# Altium schematic sheet 输出运算放大器（5）.SchDoc
size A4
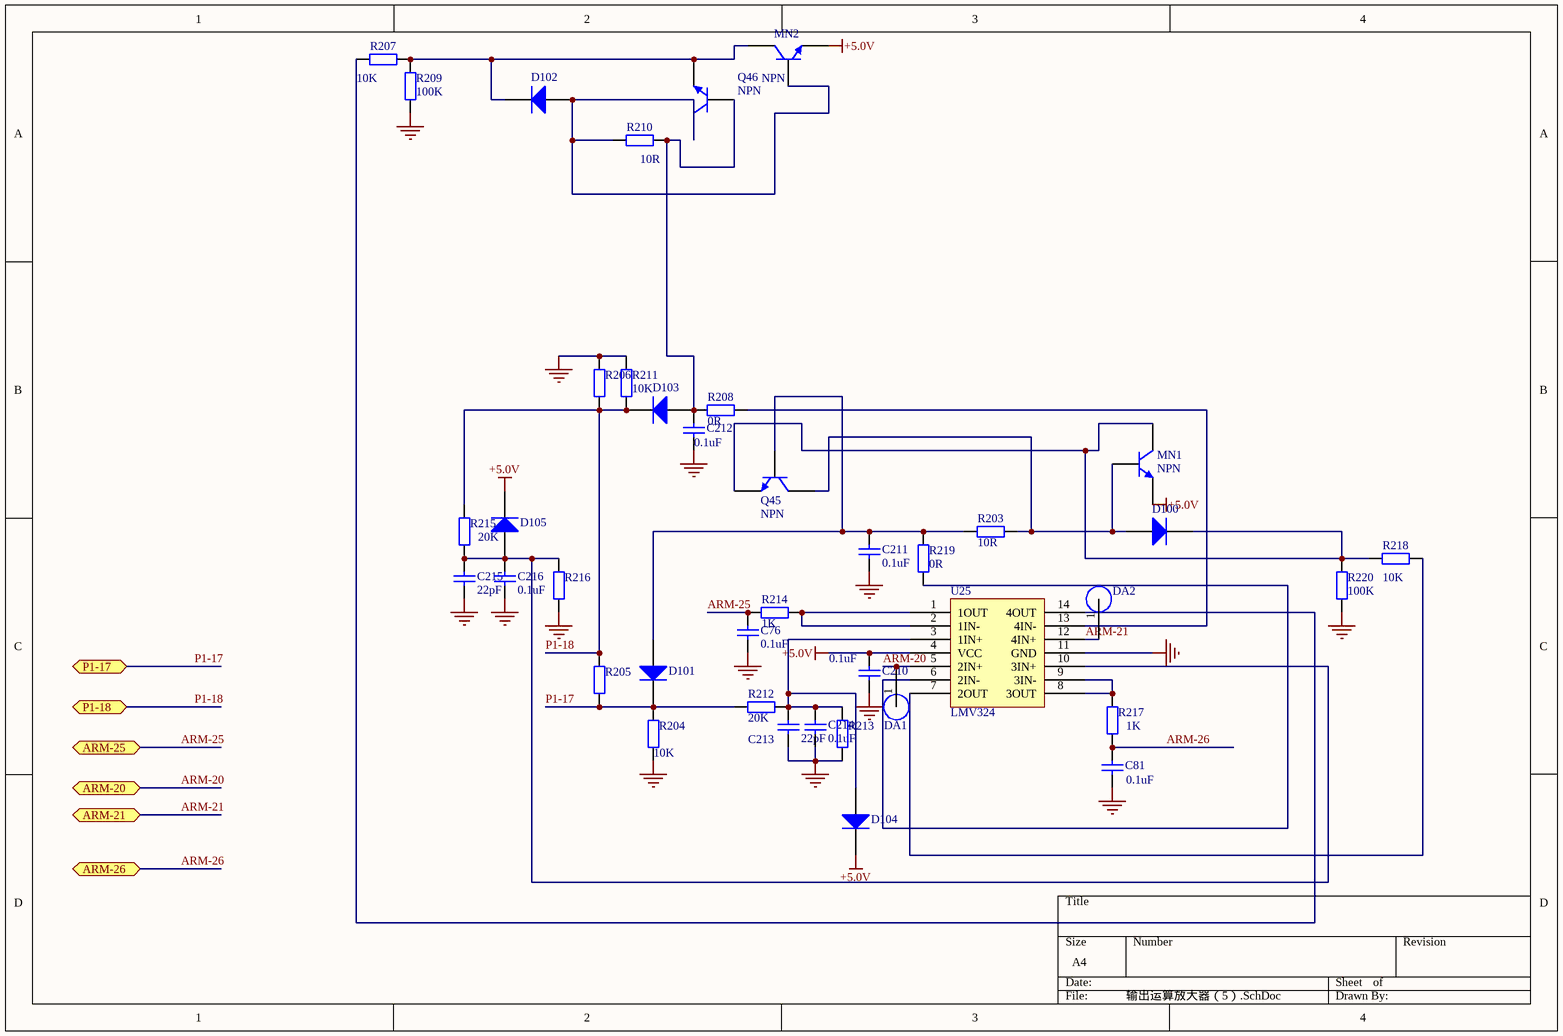
[diagram p0: 输出运算放大器（5）.SchDoc]

## Parts
C76  value 0.1uF  [C0805]  (hidden comment: Cap)
C81  value 0.1uF  [C0805]  (hidden comment: Cap)
C210  value 0.1uF  [C0805]  (hidden comment: Cap)
C211  value 0.1uF  [C0805]  (hidden comment: Cap)
C212  value 0.1uF  [C0805]  (hidden comment: Cap)
C213  value 22pF  [C0805]  (hidden comment: Cap)
C214  value 0.1uF  [C0805]  (hidden comment: Cap)
C215  value 22pF  [C0805]  (hidden comment: Cap)
C216  value 0.1uF  [C0805]  (hidden comment: Cap)
D100  Diode 1N4007  [SOD123]  (value not drawn)
D101  Diode 1N4007  [SMA]  (value not drawn)
D102  Diode 1N4007  [SOD123]  (value not drawn)
D103  Diode 1N4007  [SMA]  (value not drawn)
D104  Diode 1N4007  [SOD123]  (value not drawn)
D105  Diode 1N4007  [SOD123]  (value not drawn)
DA1  PIN  [圆形焊盘]  (value not drawn)
DA2  PIN  [圆形焊盘]  (value not drawn)
MN1  NPN  [SOT23-3]
MN2  NPN  [MN2]
Q45  NPN  [Q45]
Q46  NPN  [Q46]
R203  value 10R  [R1206]  (hidden comment: Res2)
R204  value 10K  [R0805]  (hidden comment: Res2)
R205  Res2  [R1206]  (value not drawn)
R206  Res2  [R1206]  (value not drawn)
R207  value 10K  [R0805]  (hidden comment: Res2)
R208  value 0R  [R0805]  (hidden comment: Res2)
R209  value 100K  [R0805]  (hidden comment: Res2)
R210  value 10R  [R1206]  (hidden comment: Res2)
R211  value 10K  [R0805]  (hidden comment: Res2)
R212  value 20K  [R0805]  (hidden comment: Res2)
R213  Res2  [R0805]  (value not drawn)
R214  value 1K  [R0805]  (hidden comment: Res2)
R215  value 20K  [R0805]  (hidden comment: Res2)
R216  Res2  [R0805]  (value not drawn)
R217  value 1K  [R0805]  (hidden comment: Res2)
R218  value 10K  [R0805]  (hidden comment: Res2)
R219  value 0R  [R0805]  (hidden comment: Res2)
R220  value 100K  [R0805]  (hidden comment: Res2)
U25  LMV324  [SOP-14]

## Ports
ARM-20, ARM-21, ARM-25, ARM-26, P1-17, P1-18

## Nets
+5.0V: C210.1 D104.2(K) D105.2(K) MN1.3(E) MN2.3(E) U25.4(VCC)
GND: C76.1 C81.1 C210.2 C211.2 C212.2 C213.1 C214.1 C215.1 C216.1 R204.2 R206.2 R209.2 R211.2 R213.1 R216.1 R220.1 U25.11(GND)
ARM-20: DA1.1 U25.5(2IN+) ; port ARM-20
ARM-21: DA2.1 U25.12(4IN+) ; port ARM-21
ARM-25: C76.2 R214.1 ; port ARM-25
ARM-26: C81.2 R217.1 ; port ARM-26
P1-17: D101.2(K) R204.1 R205.1 R212.1 ; port P1-17
P1-18: D103.2(K) R205.2 R206.1 R211.1 R215.1 ; port P1-18
NetC211_1: C211.1 D101.1(A) Q45.2(B) R203.1 R219.2
NetC212_1: C212.1 D103.1(A) Q46.2(B) R208.2 R210.2
NetC213_2: C213.2 C214.2 D104.1(A) R212.2 R213.2 U25.3(1IN+)
NetC215_2: C215.2 C216.2 D105.1(A) R215.2 R216.2 U25.10(3IN+)
NetD100_1: D100.1(A) MN1.2(B) Q45.1(C) R203.2
NetD100_2: D100.2(K) MN1.1(C) Q45.3(E) R218.2 R220.2
NetD102_1: D102.1(A) MN2.2(B) Q46.1(C) R210.1
NetD102_2: D102.2(K) MN2.1(C) Q46.3(E) R207.2 R209.1
NetR207_1: R207.1 U25.14(4OUT)
NetR208_1: R208.1 U25.13(4IN-)
NetR214_2: R214.2 U25.1(1OUT) U25.2(1IN-)
NetR217_2: R217.2 U25.8(3OUT) U25.9(3IN-)
NetR218_1: R218.1 U25.7(2OUT)
NetR219_1: R219.1 U25.6(2IN-)

## Library data of the parts
C76 C81 C210-C216 = Cap: Capacitor; Published: 8-Jun-2000; LatestRevisionDate: 17-Jul-2002; LatestRevisionNote: Re-released for DXP Platform.; PackageReference: RAD-0.3; Publisher: Altium Limited
D100-D105 = Diode 1N4007: 1 Amp General Purpose Rectifier; Published: 8-Jun-2000; LatestRevisionDate: 17-Jul-2002; LatestRevisionNote: Re-released for DXP Platform.; DatasheetDocument: 1998; PackageDocument: Aug-1999; PackageReference: DO-41; Publisher: Altium Limited; Code_JEDEC: DO-204-AL; ComponentLink1Description: Manufacturer Link; ComponentLink1URL: http://www.fairchildsemi.com/; ComponentLink2Description: Datasheet; ComponentLink2URL: http://www.fairchildsemi.com/ds/1N%2F1N4001.pdf
DA1 DA2 U25 = Component_1
MN1 MN2 Q45 Q46 = NPN: NPN Bipolar Transistor; Published: 8-Jun-2000; LatestRevisionDate: 17-Jul-2002; LatestRevisionNote: Re-released for DXP Platform.; PackageReference: TO-226; Publisher: Altium Limited; Code_JEDEC: TO-226-AA
R203 R204 R207-R212 R214 R215 R217-R220 = Res2: Resistor; Published: 8-Jun-2000; LatestRevisionDate: 17-Jul-2002; LatestRevisionNote: Re-released for DXP Platform.; PackageReference: AXIAL-0.4; Publisher: Altium Limited
R205 R206 R213 R216 = Res2: Resistor; Value: NC; Published: 8-Jun-2000; LatestRevisionDate: 17-Jul-2002; LatestRevisionNote: Re-released for DXP Platform.; PackageReference: AXIAL-0.4; Publisher: Altium Limited